# EAGLE design Communication (EAGLE 9.1.3)
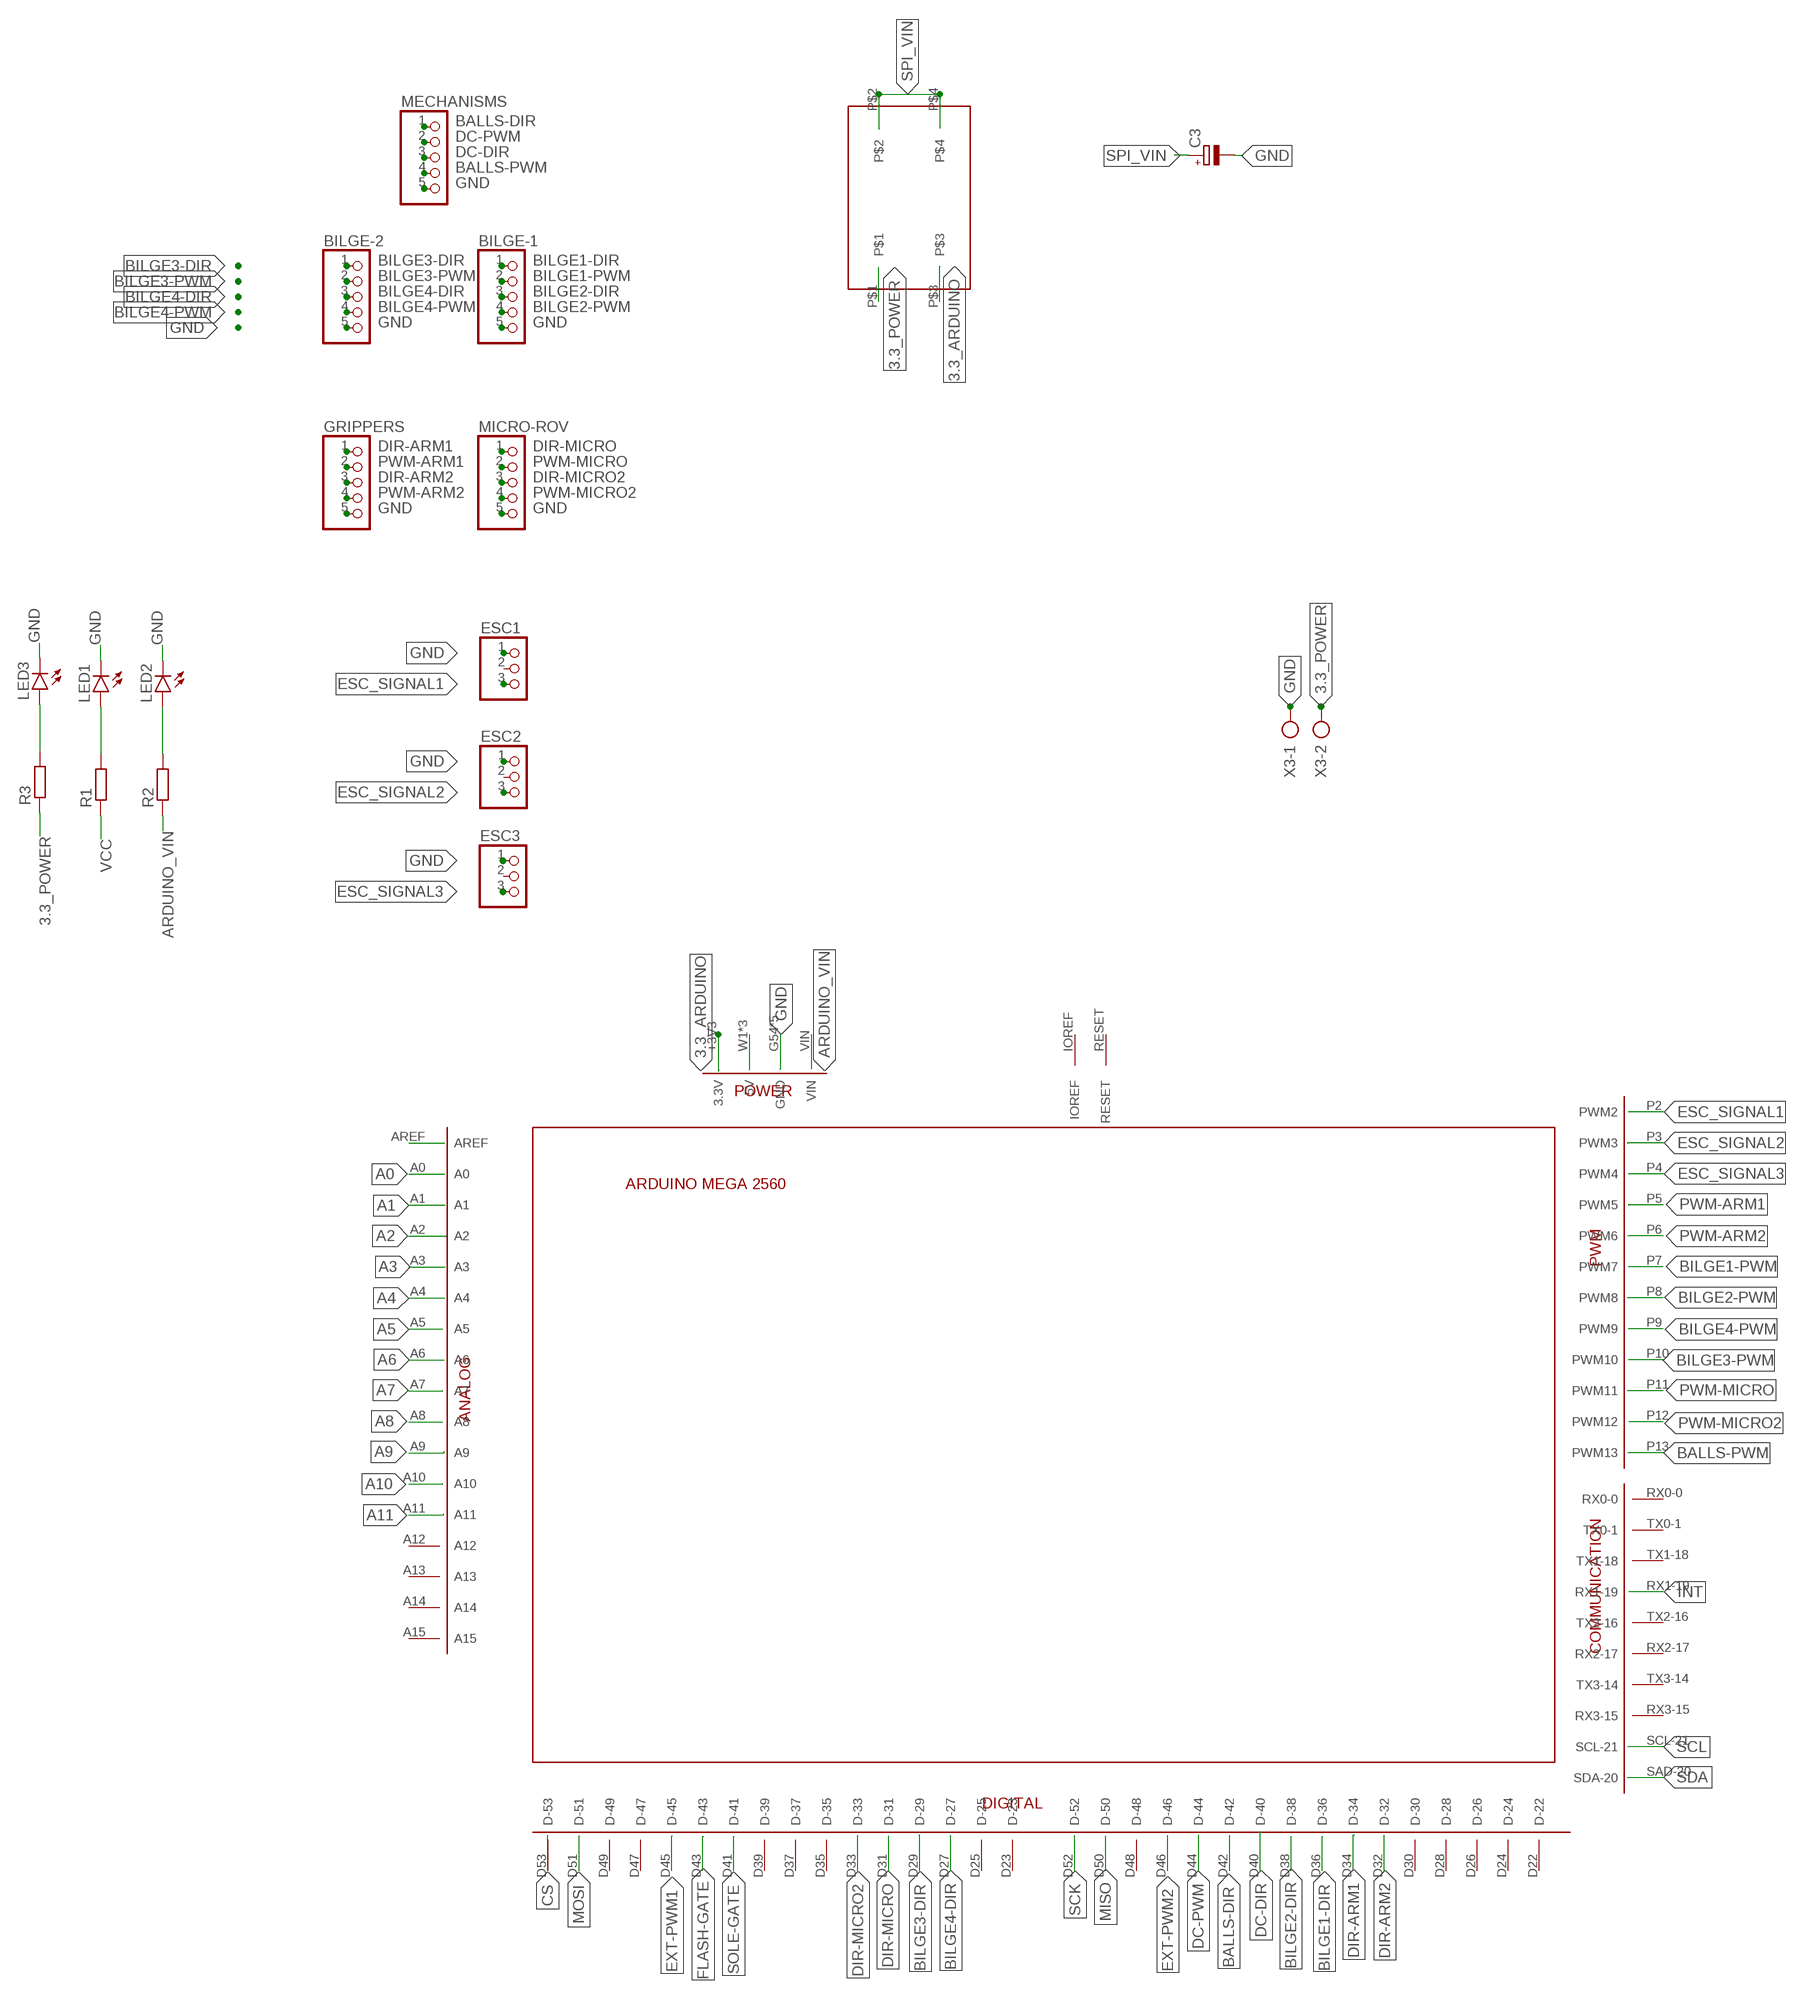
[diagram p0: schematic, sheet 1, part 1 of 2]
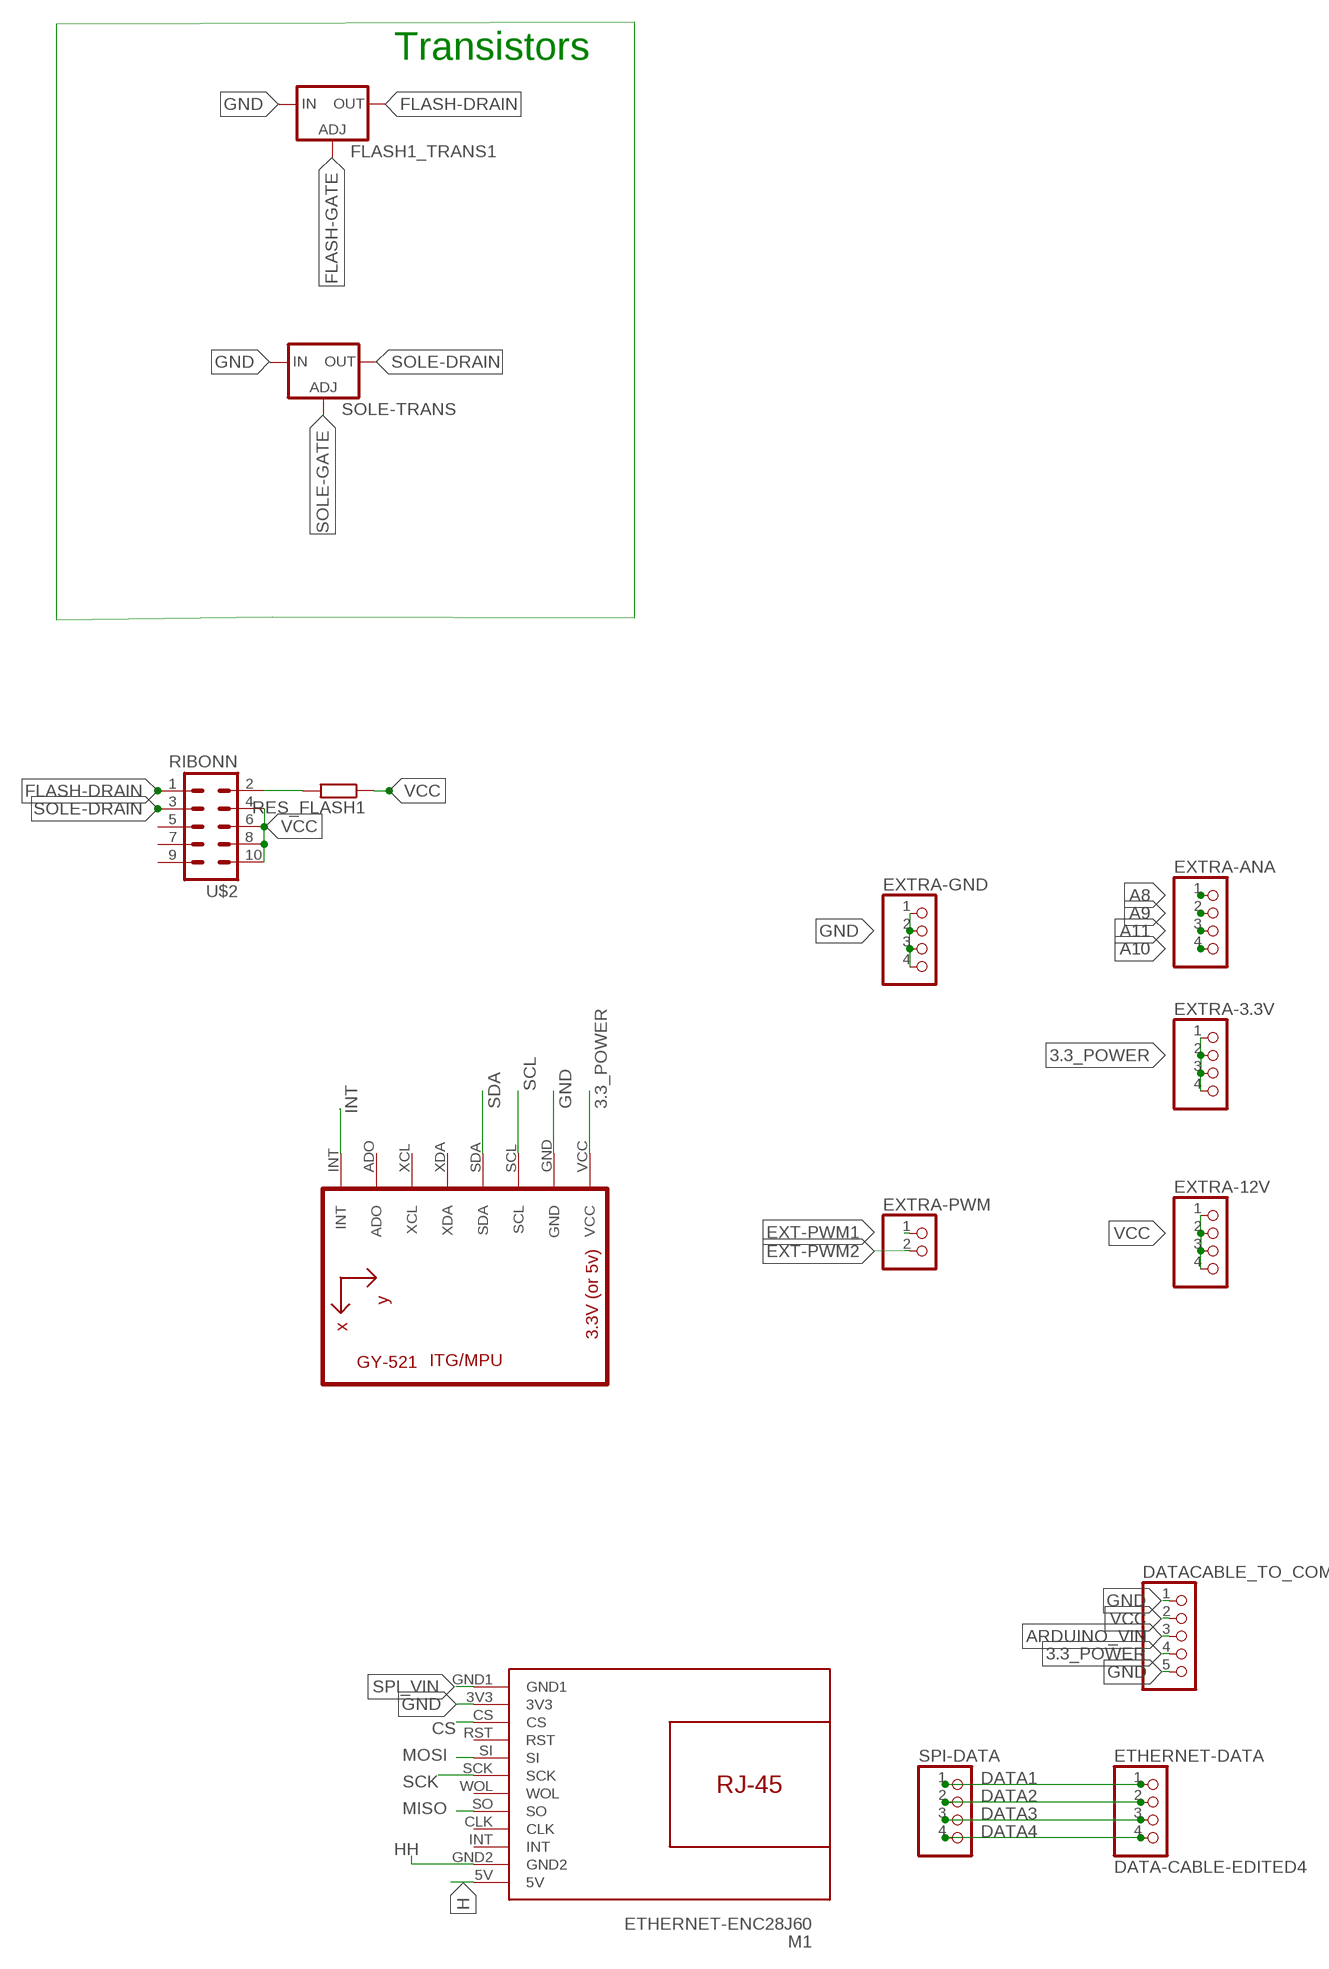
[diagram p1: schematic, sheet 1, part 2 of 2]

## Parts
BILGE-1  PINHD-1X5  [1X05]
BILGE-2  PINHD-1X5  [1X05]
C3  CPOL-EUE3.5-8  [E3,5-8]
DATACABLE_TO_COMM  PINHD-1X5  [1X05]
ESC1  PINHD-1X3  [1X03]
ESC2  PINHD-1X3  [1X03]
ESC3  PINHD-1X3  [1X03]
ETHERNET-DATA  DATA-CABLE-EDITED4  [DATA-CABLE-EDITED4]
EXTRA-3.3V  PINHD-1X4  [1X04]
EXTRA-12V  PINHD-1X4  [1X04]
EXTRA-ANA  PINHD-1X4  [1X04]
EXTRA-GND  PINHD-1X4  [1X04]
EXTRA-PWM  PINHD-1X2  [1X02]
FLASH1_TRANS1  LM317TS  [317TS]
GRIPPERS  PINHD-1X5  [1X05]
LED1  LED3MM  [LED3MM]
LED2  LED3MM  [LED3MM]
LED3  LED3MM  [LED3MM]
M1  ETHERNET-ENC28J60  [ETHERNET-ENC28J60]
MECHANISMS  PINHD-1X5  [1X05]
MICRO-ROV  PINHD-1X5  [1X05]
R1  R-EU_0207/10  [0207/10]
R2  R-EU_0207/10  [0207/10]
R3  R-EU_0207/10  [0207/10]
RES_FLASH1  R-EU_0207/10  [0207/10]
SOLE-TRANS  LM317TS  [317TS]
SPI-DATA  PINHD-1X4  [1X04]
U2  GY-521MPU6050  [GY-521]
U$1  BOARD_ARDUINO-MEGA  [BOARD_ARDUINO_MEGA]
U$2  RIBONN  [RIBONN]
U$3  DIPSWITCH_2PINS  [DIPSWITCH_2PINS]
X3  AK300/2  [AK300/2]

## Nets
3.3_ARDUINO: U$1.+3V3(3.3V) U$3.P$3
3.3_POWER: DATACABLE_TO_COMM.4 EXTRA-3.3V.1 EXTRA-3.3V.2 EXTRA-3.3V.3 EXTRA-3.3V.4 R3.1 U2.VCC U$3.P$1 X3.2
A0: U$1.A0
A1: U$1.A1
A2: U$1.A2
A3: U$1.A3
A4: U$1.A4
A5: U$1.A5
A6: U$1.A6
A7: U$1.A7
A8: EXTRA-ANA.1 U$1.A8
A9: EXTRA-ANA.2 U$1.A9
A10: EXTRA-ANA.4 U$1.A10
A11: EXTRA-ANA.3 U$1.A11
ARDUINO_VIN: DATACABLE_TO_COMM.3 R2.1 U$1.VIN
BALLS-DIR: MECHANISMS.1 U$1.D42(D-42)
BALLS-PWM: MECHANISMS.4 U$1.P13(PWM13)
BILGE1-DIR: BILGE-1.1 U$1.D36(D-36)
BILGE1-PWM: BILGE-1.2 U$1.P7(PWM7)
BILGE2-DIR: BILGE-1.3 U$1.D38(D-38)
BILGE2-PWM: BILGE-1.4 U$1.P8(PWM8)
BILGE3-DIR: BILGE-2.1 U$1.D29(D-29)
BILGE3-PWM: BILGE-2.2 U$1.P10(PWM10)
BILGE4-DIR: BILGE-2.3 U$1.D27(D-27)
BILGE4-PWM: BILGE-2.4 U$1.P9(PWM9)
CS: M1.CS U$1.D53(D-53)
DATA1: ETHERNET-DATA.1 SPI-DATA.1
DATA2: ETHERNET-DATA.2 SPI-DATA.2
DATA3: ETHERNET-DATA.3 SPI-DATA.3
DATA4: ETHERNET-DATA.4 SPI-DATA.4
DC-DIR: MECHANISMS.3 U$1.D40(D-40)
DC-PWM: MECHANISMS.2 U$1.D44(D-44)
DIR-ARM1: GRIPPERS.1 U$1.D34(D-34)
DIR-ARM2: GRIPPERS.3 U$1.D32(D-32)
DIR-MICRO: MICRO-ROV.1 U$1.D31(D-31)
DIR-MICRO2: MICRO-ROV.3 U$1.D33(D-33)
ESC_SIGNAL1: ESC1.3 U$1.P2(PWM2)
ESC_SIGNAL2: ESC2.3 U$1.P3(PWM3)
ESC_SIGNAL3: ESC3.3 U$1.P4(PWM4)
EXT-PWM1: EXTRA-PWM.1 U$1.D45(D-45)
EXT-PWM2: EXTRA-PWM.2 U$1.D46(D-46)
FLASH-DRAIN: FLASH1_TRANS1.2(OUT) U$2.1
FLASH-GATE: FLASH1_TRANS1.1(ADJ) U$1.D43(D-43)
GND: BILGE-1.5 BILGE-2.5 C3.- DATACABLE_TO_COMM.1 DATACABLE_TO_COMM.5 ESC1.1 ESC2.1 ESC3.1 EXTRA-GND.1 EXTRA-GND.2 EXTRA-GND.3 EXTRA-GND.4 FLASH1_TRANS1.3(IN) GRIPPERS.5 LED1.K(C) LED2.K(C) LED3.K(C) M1.3V3 MECHANISMS.5 MICRO-ROV.5 SOLE-TRANS.3(IN) U2.GND U$1.G54(GND) U$1.G55(GND) U$1.G56(GND) U$1.G57(GND) U$1.G58(GND) X3.1
H: M1.5V
HH: M1.GND2
INT: U2.INT U$1.RX1-19
MISO: M1.SO U$1.D50(D-50)
MOSI: M1.SI U$1.D51(D-51)
N$1: LED1.A R1.2
N$2: LED2.A R2.2
N$3: U$1.AREF
N$4: RES_FLASH1.2 U$2.2
N$11: LED3.A R3.2
N$119: U$1.W1(5V) U$1.W2(5V) U$1.W3(5V)
PWM-ARM1: GRIPPERS.2 U$1.P5(PWM5)
PWM-ARM2: GRIPPERS.4 U$1.P6(PWM6)
PWM-MICRO: MICRO-ROV.2 U$1.P11(PWM11)
PWM-MICRO2: MICRO-ROV.4 U$1.P12(PWM12)
SCK: M1.SCK U$1.D52(D-52)
SCL: U2.SCL U$1.SCL-21
SDA: U2.SDA U$1.SAD-20(SDA-20)
SOLE-DRAIN: SOLE-TRANS.2(OUT) U$2.3
SOLE-GATE: SOLE-TRANS.1(ADJ) U$1.D41(D-41)
SPI_VIN: C3.+ M1.GND1 U$3.P$2 U$3.P$4
VCC: DATACABLE_TO_COMM.2 EXTRA-12V.1 EXTRA-12V.2 EXTRA-12V.3 EXTRA-12V.4 R1.1 RES_FLASH1.1 U$2.4 U$2.6 U$2.8 U$2.10
Unconnected: ESC1.2 ESC2.2 ESC3.2 M1.CLK M1.INT M1.RST M1.WOL U2.ADO U2.XCL U2.XDA U$1.A12 U$1.A13 U$1.A14 U$1.A15 U$1.D22(D-22) U$1.D23(D-23) U$1.D24(D-24) U$1.D25(D-25) U$1.D26(D-26) U$1.D28(D-28) U$1.D30(D-30) U$1.D35(D-35) U$1.D37(D-37) U$1.D39(D-39) U$1.D47(D-47) U$1.D48(D-48) U$1.D49(D-49) U$1.IOREF U$1.RESET U$1.RX0-0 U$1.RX2-17 U$1.RX3-15 U$1.TX0-1 U$1.TX1-18 U$1.TX2-16 U$1.TX3-14 U$2.5 U$2.7 U$2.9

## Notes on the sheet
- Transistors

## Library data of the parts
BILGE-1 BILGE-2 DATACABLE_TO_COMM GRIPPERS MECHANISMS MICRO-ROV = pinhead:PINHD-1X5: PIN HEADER
C3 = rcl:CPOL-EU: POLARIZED CAPACITOR, European symbol; SPICEPREFIX: C
ESC1-ESC3 = pinhead:PINHD-1X3: PIN HEADER
ETHERNET-DATA = Data-Cable-Edited5:DATA-CABLE-EDITED4
EXTRA-3.3V EXTRA-12V EXTRA-ANA EXTRA-GND SPI-DATA = pinhead:PINHD-1X4: PIN HEADER
EXTRA-PWM = pinhead:PINHD-1X2: PIN HEADER
FLASH1_TRANS1 SOLE-TRANS = v-reg:LM317TS: VOLTAGE REGULATOR
LED1-LED3 = led:LED: LED OSRAM: - CHIPLED LG R971, LG N971, LY N971, LG Q971, LY Q971, LO R971, LY R971 LH N974, LH R974 LS Q976, LO Q976, LY Q976 LO Q996 - Hyper CHIPLED LW Q18S LB Q993, LB Q99A, LB R99A - SideLED LS A670, LO A670, LY A670, LG A670, LP A670 LB A673, LV A673, LT A673, LW A673 LH A674 LY A675 LS A676, LA A676, LO A676, LY A676, LW A676 LS A679, LY A679, LG A679 - Hyper Micro SIDELED® LS Y876, LA Y876, LO Y876, LY Y876 LT Y87S - SmartLED LW L88C, LW L88S LB L89C, LB L89S, LG L890 LS L89K, LO L89K, LY L89K LS L896, LA L896, LO L896, LY L896 - TOPLED LS T670, LO T670, LY T670, LG T670, LP T670 LSG T670, LSP T670, LSY T670, LOP T670, LYG T670 LG T671, LOG T671, LSG T671 LB T673, LV T673, LT T673, LW T673 LH T674 LS T676, LA T676, LO T676, LY T676, LB T676, LH T676, LSB T676, LW T676 LB T67C, LV T67C, LT T67C, LS T67K, LO T67K, LY T67K, LW E67C LS E67B, LA E67B, LO E67B, LY E67B, LB E67C, LV E67C, LT E67C LW T67C LS T679, LY T679, LG T679 LS T770, LO T770, LY T770, LG T770, LP T770 LB T773, LV T773, LT T773, LW T773 LH T774 LS E675, LA E675, LY E675, LS T675 LS T776, LA T776, LO T776, LY T776, LB T776 LHGB T686 LT T68C, LB T68C - Hyper Mini TOPLED® LB M676 - Mini TOPLED Santana® LG M470 LS M47K, LO M47K, LY M47K Source: http://www.osram.convergy.de LUXEON: - LUMILED® LXK2-PW12-R00, LXK2-PW12-S00, LXK2-PW14-U00, LXK2-PW14-V00 LXK2-PM12-R00, LXK2-PM12-S00, LXK2-PM14-U00 LXK2-PE12-Q00, LXK2-PE12-R00, LXK2-PE12-S00, LXK2-PE14-T00, LXK2-PE14-U00 LXK2-PB12-K00, LXK2-PB12-L00, LXK2-PB12-M00, LXK2-PB14-N00, LXK2-PB14-P00, LXK2-PB14-Q00 LXK2-PR12-L00, LXK2-PR12-M00, LXK2-PR14-Q00, LXK2-PR14-R00 LXK2-PD12-Q00, LXK2-PD12-R00, LXK2-PD12-S00 LXK2-PH12-R00, LXK2-PH12-S00 LXK2-PL12-P00, LXK2-PL12-Q00, LXK2-PL12-R00 Source: www.luxeon.com KINGBRIGHT: KA-3528ASYC Source: www.kingbright.com
M1 = Ethernet_TO_SPI Module:ETHERNET-ENC28J60: Ethernet Module based on ENC28J60 chip Click here to find device on ebay.com <http://www.ebay.com/sch/end28j60+ethernet+lan+module> Note: There are many variants. Search for the proper version.
R1-R3 RES_FLASH1 = rcl:R-EU_: RESISTOR, European symbol; SPICEPREFIX: R
U2 = MPU-5060 -with double pinheaders:GY-521
U$1 = Arduino Mega_EDITED:BOARD_ARDUINO-MEGA
U$2 = RIBONN:RIBONN
U$3 = dipswitch_2pins:DIPSWITCH_2PINS
X3 = con-ptr500:AK300/2: CONNECTOR; OC_FARNELL: unknown; OC_NEWARK: unknown

## Module FLASH
Ports: +12V(io) GND(io) PWM(in) -VE_FLASH(io)
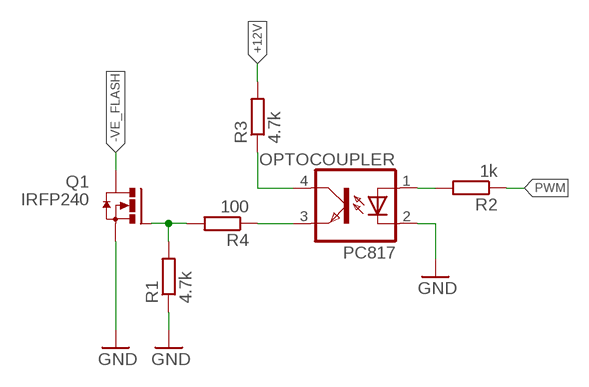
[diagram p2: schematic, module FLASH, sheet 1]

### Parts
OPTOCOUPLER  PC817  [DIL04]
Q1  IRFP240  [TO247BV]
R1  4.7k  R-EU_0207/10  [0207/10]
R2  1k  R-EU_0207/10  [0207/10]
R3  4.7k  R-EU_0207/10  [0207/10]
R4  100  R-EU_0207/10  [0207/10]

### Nets
+12V: R3.2
-VE_FLASH: Q1.D
GND: OPTOCOUPLER.2(C) Q1.S R1.1
N$1: Q1.G R1.2 R4.2
N$2: OPTOCOUPLER.4(COL) R3.1
N$3: OPTOCOUPLER.3(EMIT) R4.1
N$7: OPTOCOUPLER.1(A) R2.2
PWM: R2.1

### Library data of the parts
OPTOCOUPLER = optocoupler:PC817: SHARP OPTO COUPLER; MPN: PC817X4J000F; OC_FARNELL: 9707727; OC_NEWARK: 97K7059
Q1 = transistor-power:IRFP240: HEXFET Power MosFet Source: http://www.irf.com/
R1-R4 = rcl:R-EU_: RESISTOR, European symbol; SPICEPREFIX: R

## Board
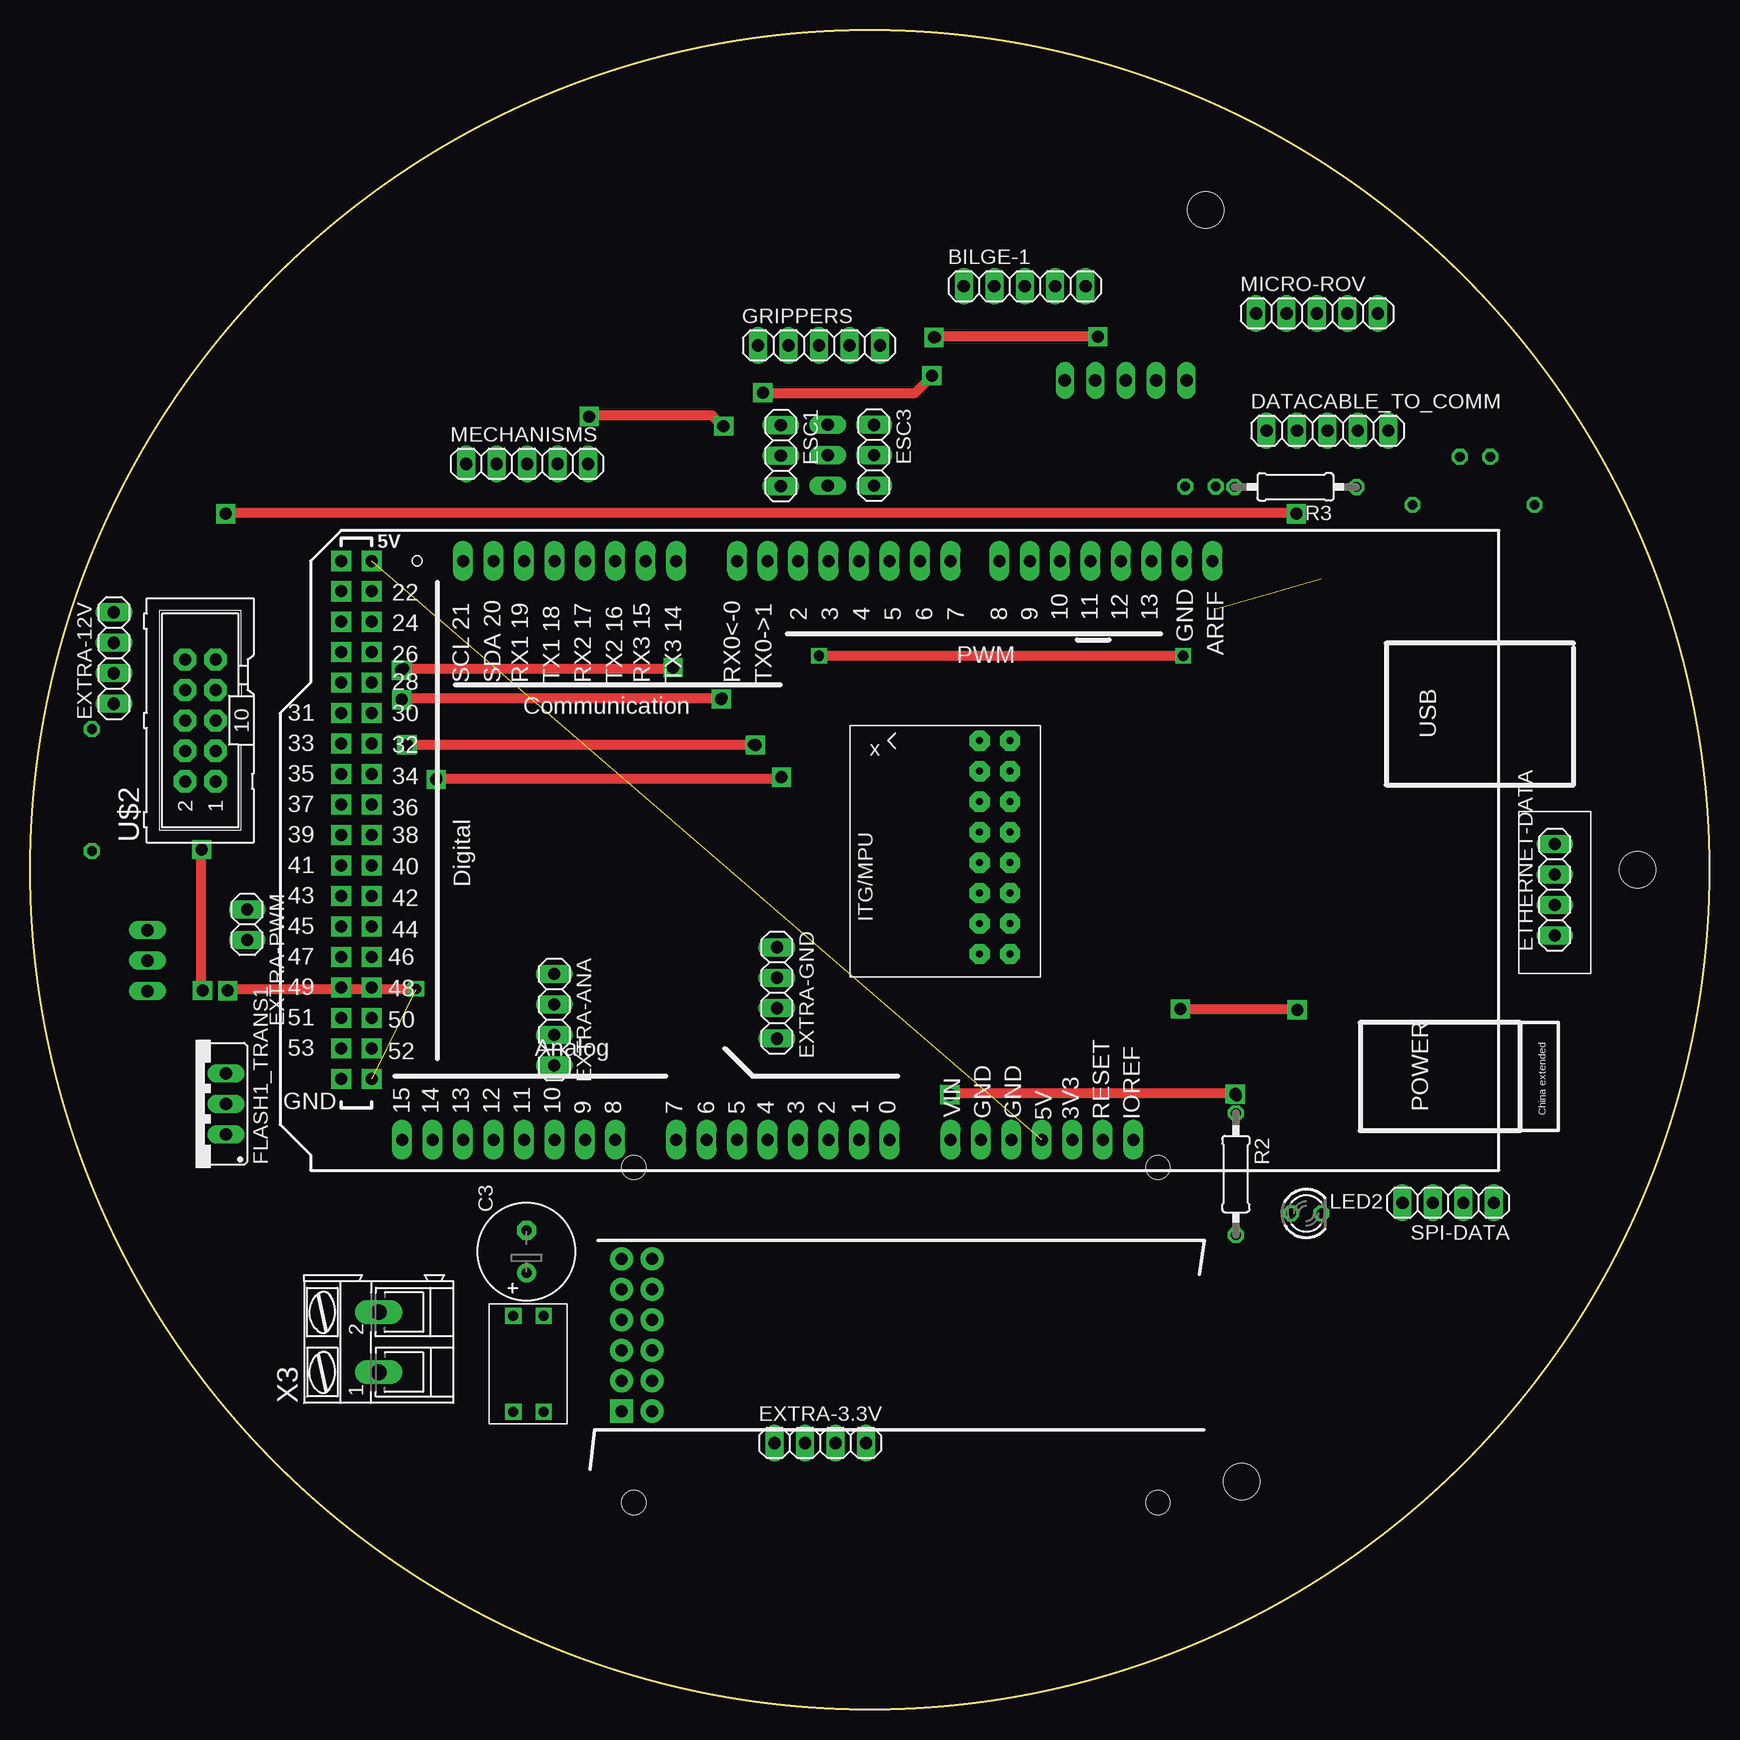
[diagram p3: board, top side]
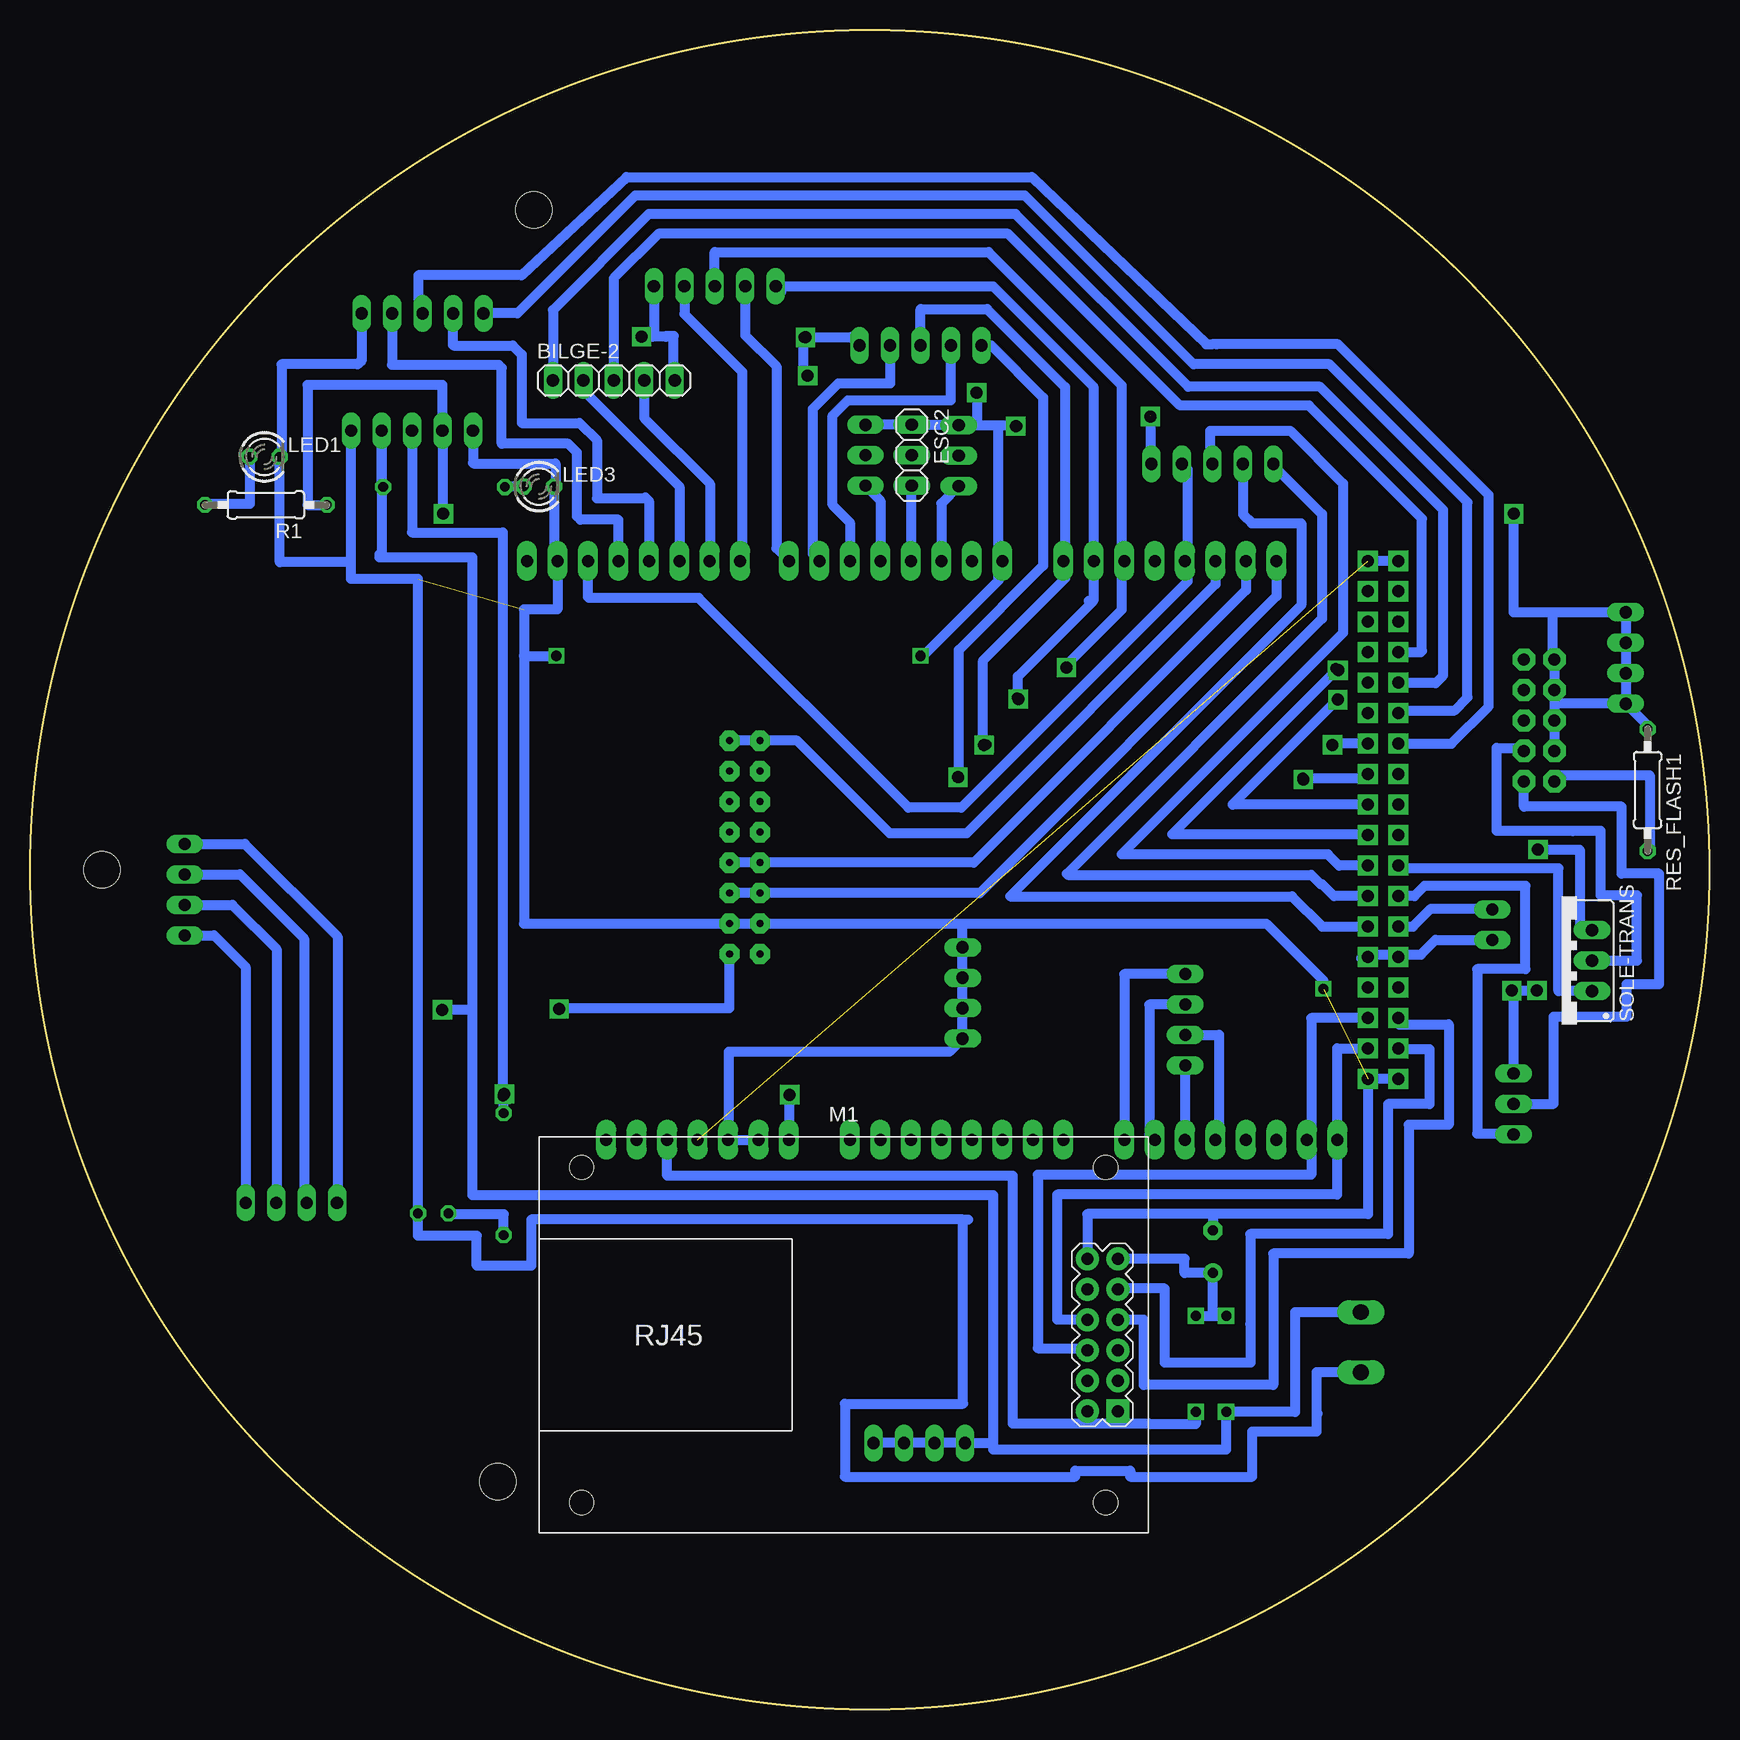
[diagram p4: board, bottom side, seen from below]

Size 140 x 140 mm. Coordinates in mm from the lower left corner, seen from the top.
Outline: circle at 70,70 radius 70
Copper layers (1*16): Top 0.035mm / dielectric 1.5mm / Bottom 0.035mm
Design rules "default *": minimum track width 0.5mm, minimum drill 0.35mm, track to track 0.8mm, track to pad 0.8mm, pad to pad 0.8mm, via to via 0.8mm, smd to smd 0.8mm, copper to edge 40mil, drill to drill 0.8mm, minimum pad ring 10mil, minimum via ring 8mil, stop-mask expansion 4mil, vias tented up to drill 0mil, thermal gap 10mil
Holes 3 mm at 134,70 101,19 98,125

### Footprints (pad centres in the part's own frame; a part is rotated, then mirrored left to right if it is on the bottom)
1X05 = drill 1.016 long: 1 -5.08,0; 2 -2.54,0; 3 0,0; 4 2.54,0; 5 5.08,0
E3,5-8 = drill 0.813 pad 1.6: + -1.778,0 | drill 0.813 pad 1.6 octagon: - 1.778,0
1X03 = drill 1.016 long: 1 -2.54,0; 2 0,0; 3 2.54,0
DATA-CABLE-EDITED4 = drill 1.016 long: 1 3.19,-3; 2 5.73,-3; 3 8.27,-3; 4 10.81,-3
1X04 = drill 1.016 long: 1 -3.81,0; 2 -1.27,0; 3 1.27,0; 4 3.81,0
1X02 = drill 1.016 long: 1 -1.27,0; 2 1.27,0
317TS = drill 1.016 long: 1 -2.54,-2.54; 2 0,-2.54; 3 2.54,-2.54
LED3MM = drill 0.813 octagon: A -1.27,0; K 1.27,0
ETHERNET-ENC28J60 = drill 1 pad 1.93: 3V3 20.32,6.35; 5V 20.32,-6.35; CLK 22.86,-3.81; CS 22.86,3.81; GND1 22.86,6.35; INT 20.32,-3.81; RST 20.32,3.81; SCK 20.32,1.27; SI 22.86,1.27; SO 20.32,-1.27; WOL 22.86,-1.27 | drill 1 pad 1.93 square: GND2 22.86,-6.35 | hole 2: -21.844,13.97; 21.844,13.97; -21.844,-13.97; 21.844,-13.97
0207/10 = drill 0.813 octagon: 1 -5.08,0; 2 5.08,0
GY-521 = drill 0.6 pad 1.7 octagon: ADO -8.89,-6.35; ADO1 -6.35,-6.35; GND -8.89,6.35; GND1 -6.35,6.35; INT -8.89,-8.89; INT1 -6.35,-8.89; SCL -8.89,3.81; SCL1 -6.35,3.81; SDA -8.89,1.27; SDA1 -6.35,1.27; VCC -8.89,8.89; VCC1 -6.35,8.89; XCL -8.89,-3.81; XCL1 -6.35,-3.81; XDA -8.89,-1.27; XDA1 -6.35,-1.27
BOARD_ARDUINO_MEGA = drill 1 pad 1.676 long: +3V3 35.56,50.8; A0 50.8,50.8; A1 53.34,50.8; A2 55.88,50.8; A3 58.42,50.8; A4 60.96,50.8; A5 63.5,50.8; A6 66.04,50.8; A7 68.58,50.8; A8 73.66,50.8; A9 76.2,50.8; A10 78.74,50.8; A11 81.28,50.8; A12 83.82,50.8; A13 86.36,50.8; A14 88.9,50.8; A15 91.44,50.8; AREF 23.876,2.54; G56 43.18,50.8; G57 40.64,50.8; G58 26.416,2.54; IOREF 30.48,50.8; P2 58.42,2.54; P3 55.88,2.54; P4 53.34,2.54; P5 50.8,2.54; P6 48.26,2.54; P7 45.72,2.54; P8 41.656,2.54; P9 39.116,2.54; P10 36.576,2.54; P11 34.036,2.54; P12 31.496,2.54; P13 28.956,2.54; RESET 33.02,50.8; RX0-0 63.5,2.54; RX1-19 81.28,2.54; RX2-17 76.2,2.54; RX3-15 71.12,2.54; SAD-20 83.82,2.54; SCL-21 86.36,2.54; TX0-1 60.96,2.54; TX1-18 78.74,2.54; TX2-16 73.66,2.54; TX3-14 68.58,2.54; VIN 45.72,50.8; W1 38.1,50.8 | drill 1 pad 1.676 square: D22 93.98,5.08; D23 96.52,5.08; D24 93.98,7.62; D25 96.52,7.62; D26 93.98,10.16; D27 96.52,10.16; D28 93.98,12.7; D29 96.52,12.7; D30 93.98,15.24; D31 96.52,15.24; D32 93.98,17.78; D33 96.52,17.78; D34 93.98,20.32; D35 96.52,20.32; D36 93.98,22.86; D37 96.52,22.86; D38 93.98,25.4; D39 96.52,25.4; D40 93.98,27.94; D41 96.52,27.94; D42 93.98,30.48; D43 96.52,30.48; D44 93.98,33.02; D45 96.52,33.02; D46 93.98,35.56; D47 96.52,35.56; D48 93.98,38.1; D49 96.52,38.1; D50 93.98,40.64; D51 96.52,40.64; D52 93.98,43.18; D53 96.52,43.18; G54 93.98,45.72; G55 96.52,45.72; W2 93.98,2.54; W3 96.52,2.54
RIBONN = drill 1 pad 1.85 octagon: 1 -5.08,-1.27; 2 -5.08,1.27; 3 -2.54,-1.27; 4 -2.54,1.27; 5 0,-1.27; 6 0,1.27; 7 2.54,-1.27; 8 2.54,1.27; 9 5.08,-1.27; 10 5.08,1.27
DIPSWITCH_2PINS = drill 0.85 square: P$1 2,1; P$2 2,9; P$3 4.54,1; P$4 4.54,9
AK300/2 = drill 1.321 long: 1 -2.515,0; 2 2.489,0

### Placement (x,y rotation side)
BILGE-1  82.92,118.65 0 top
BILGE-2  91.33,110.79 0 bottom
C3  41.39,38.17 90 top
DATACABLE_TO_COMM  108.16,106.6 0 top
ESC1  62.59,104.51 270 top
ESC2  66.5,104.56 270 bottom
ESC3  70.35,104.55 270 top
ETHERNET-DATA  124.1,61.34 90 top
EXTRA-3.3V  65.87,22.21 0 top
EXTRA-12V  6.99,87.65 90 top
EXTRA-ANA  43.7,57.5 270 top
EXTRA-GND  62.26,59.73 270 top
EXTRA-PWM  18.1,65.42 270 top
FLASH1_TRANS1  13.8,50.49 90 top
GRIPPERS  65.77,113.71 0 top
LED1  120.45,104.42 0 bottom
LED2  106.39,41.36 0 top
LED3  97.57,101.95 0 bottom
M1  72.18,31.22 0 bottom
MECHANISMS  41.43,103.84 0 top
MICRO-ROV  107.28,116.38 0 top
R1  120.34,100.41 180 bottom
R2  100.52,44.63 270 top
R3  105.49,101.91 180 top
RES_FLASH1  5.16,76.64 270 bottom
SOLE-TRANS  12.33,62.42 90 bottom
SPI-DATA  118.22,42.24 180 top
U2  72.8,71.87 180 top
U$1  122.45,98.29 180 top
U$2  14.19,82.45 90 top
U$3  38.28,23.81 0 top
X3  29.07,30.63 90 top

### Tracks (layer width: path | path; a pad name or v marks a point on that pad's centre or on a via)
3.3_ARDUINO
  Bottom 0.813: U$1.+3V3 86.89,44.5 58.07,44.5 58.07,23.82 46.69,23.82 46.66,23.79 46.22,23.79 42.82,23.79 U$3.P$3
3.3_POWER  (via drill 0.35, 0.85 pad 1.2)
  Top 0.813: v105.57,58.36 95.91,58.36 v95.85,58.42
  Bottom 0.813: EXTRA-3.3V.4 EXTRA-3.3V.3 EXTRA-3.3V.2 EXTRA-3.3V.1 59.71,22.21 | 103.14,58.3 103.14,96.06 110.89,96.06 110.89,96.28 110.7,96.28 DATACABLE_TO_COMM.4 110.7,101.91 R3.1 | 103.14,58.3 103.14,42.88 59.71,42.88 59.71,22.21 | 103.14,58.3 105.51,58.3 v105.57,58.36 | v95.85,58.42 v95.85,58.44 81.69,58.44 U2.VCC | X3.2 34.54,33.12 34.56,33.1 34.56,24.81 U$3.P$1 40.28,21.67 59.71,21.67 59.71,22.21
A8
  Bottom 0.813: EXTRA-ANA.1 48.79,61.31 U$1.A8
A9
  Bottom 0.813: EXTRA-ANA.2 46.69,58.77 46.69,47.93 U$1.A9
A10
  Bottom 0.813: EXTRA-ANA.4 U$1.A10
A11
  Bottom 0.813: EXTRA-ANA.3 40.88,56.23 40.88,47.78 U$1.A11
ARDUINO_VIN  (via drill 0.35)
  Top 0.813: v100.47,51.16 100.29,51.34 76.79,51.34 v76.71,51.26
  Bottom 0.813: DATACABLE_TO_COMM.3 108.16,98.12 100.59,98.12 100.59,51.16 | 100.59,51.16 v100.47,51.16 | v76.71,51.26 76.71,50.55 76.71,47.49 U$1.VIN | R2.1 100.52,51.09 100.59,51.16
BALLS-DIR
  Bottom 0.813: U$1.D42 31.31,67.81 32.31,68.81 32.43,68.81 33.19,69.57 53.5,69.57 53.58,69.65 32.31,90.92 32.31,99.66 36.35,103.7 MECHANISMS.1
BALLS-PWM
  Bottom 0.813: MECHANISMS.4 43.51,103.38 43.51,94.03 62.36,75.18 66.79,75.18 84.26,92.65 93.41,92.65 93.49,92.73 U$1.P13
BILGE1-DIR  (via drill 0.35)
  Top 0.813: v30.96,84.3 57.6,84.3 v57.65,84.35
  Bottom 0.813: U$1.D36 39.74,75.43 39.76,75.45 30.96,84.25 v30.96,84.3 | v57.65,84.35 57.65,86.11 51.36,92.4 | 51.36,92.4 51.75,92.4 | 77.84,118.94 BILGE-1.1 | 51.36,92.4 51.36,110.28 59.73,118.65 BILGE-1.1 | BILGE-1.1 77.36,118.17
BILGE1-PWM
  Bottom 0.813: U$1.P7 77.79,96.81 77.79,111.97 80.38,114.56 BILGE-1.2
BILGE2-DIR  (via drill 0.35)
  Top 0.813: v31.12,86.78 53.3,86.78 v53.59,87.07
  Bottom 0.813: U$1.D38 28.53,72.95 44.8,72.95 31.12,86.63 v31.12,86.78 | v53.59,87.07 48.98,91.68 48.98,110.36 60.1,121.48 82.92,121.48 BILGE-1.3 82.97,118.69
BILGE2-PWM
  Bottom 0.813: U$1.P8 80.62,95.92 80.62,111.49 83.74,114.61 85.46,116.33 BILGE-1.4
BILGE3-DIR
  Bottom 0.813: U$1.D29 22.85,85.59 22.82,85.56 22.19,86.19 22.19,99.99 32.46,110.26 43.45,110.26 57.84,124.65 88.42,124.65 96.41,116.66 BILGE-2.1
BILGE3-PWM
  Bottom 0.813: BILGE-2.2 93.87,109.95 85.87,101.95 U$1.P10
BILGE4-DIR
  Bottom 0.813: U$1.D27 24.09,88.13 23.96,88.26 23.96,99.26 33.39,108.69 44.14,108.69 58.47,123.02 87.61,123.02 91.33,119.3 BILGE-2.3
BILGE4-PWM
  Bottom 0.813: U$1.P9 83.32,95.76 83.32,102.18 88.79,107.65 BILGE-2.4
CS
  Bottom 0.813: U$1.D53 25.93,55.05 23.35,55.05 23.35,50.47 26.8,50.47 26.8,39.64 38.29,39.64 38.29,32.14 38.26,32.14 38.26,28.9 45.41,28.9 45.41,35.09 49.32,35.09 M1.CS
DATA1
  Bottom 0.813: SPI-DATA.1 122.03,61.9 124.66,64.53 ETHERNET-DATA.1
DATA2
  Bottom 0.813: ETHERNET-DATA.2 123.14,67.07 119.45,63.38 119.45,42.28 SPI-DATA.2
DATA3
  Bottom 0.813: ETHERNET-DATA.3 122.49,69.61 117.15,64.27 117.15,42.44 SPI-DATA.3
DATA4
  Bottom 0.813: ETHERNET-DATA.4 122.09,72.15 114.37,64.43 114.37,42.28 SPI-DATA.4
DC-DIR
  Bottom 0.813: U$1.D40 30.88,70.35 31.81,71.28 49.02,71.28 30.55,89.75 30.55,102.2 34.94,106.59 41.64,106.59 41.64,104.05 MECHANISMS.3
DC-PWM
  Bottom 0.813: U$1.D44 32.29,65.27 34.81,67.79 58.31,67.79 34.04,92.06 34.04,98.88 38.16,98.88 38.89,99.61 MECHANISMS.2
DIR-ARM1  (via drill 0.35)
  Top 0.813: v33.89,77.61 v62.57,77.61
  Bottom 0.813: U$1.D34 28.83,77.61 v33.89,77.61 | v62.57,77.61 62.57,88.32 55.55,95.34 55.55,109.37 59.89,113.71 GRIPPERS.1
DIR-ARM2  (via drill 0.35)
  Top 0.813: v31.36,80.45 60.25,80.45 v60.3,80.4
  Bottom 0.813: U$1.D32 31.3,80.51 v31.36,80.45 | v60.3,80.4 60.55,80.65 60.55,87.45 53.71,94.29 53.71,110.24 60.22,116.75 65.77,116.75 GRIPPERS.3
DIR-MICRO
  Bottom 0.813: U$1.D31 25.69,83.29 21.24,83.29 20.17,84.36 20.17,100.63 31.67,112.13 43.01,112.13 57.07,126.19 89.55,126.19 99.36,116.38 MICRO-ROV.1
DIR-MICRO2
  Bottom 0.813: U$1.D33 21.51,80.51 18.4,83.62 18.4,101.25 30.96,113.81 41.09,113.81 41.5,113.81 41.94,113.81 56.5,127.73 90.27,127.73 99.04,119.55 107.64,119.55 107.64,117.58 107.28,117.22 MICRO-ROV.3
ESC_SIGNAL1
  Bottom 0.813: ESC1.3 64.03,100.53 U$1.P2
ESC_SIGNAL2
  Bottom 0.813: ESC2.3 66.57,101.95 U$1.P3
ESC_SIGNAL3
  Bottom 0.813: ESC3.3 69.11,100.77 U$1.P4
EXT-PWM1
  Bottom 0.813: EXTRA-PWM.1 18.18,66.77 23.21,66.77 24.71,65.27 U$1.D45
EXT-PWM2
  Bottom 0.813: 29.04,62.63 28.57,62.63 U$1.D46 28.27,62.93 24.06,62.93 22.84,64.15 EXTRA-PWM.2
FLASH-DRAIN
  Bottom 0.813: U$2.1 15.46,75.26 7.33,75.26 7.33,69.67 4.19,69.67 4.19,60.46 6.9,60.46 6.9,57.76 13,57.76 13,50.48 FLASH1_TRANS1.2
FLASH-GATE
  Bottom 0.813: FLASH1_TRANS1.1 16.34,48.02 19.37,48.02 19.37,61.71 15.34,61.71 15.34,68.65 23.76,68.65 24.6,67.81 U$1.D43
GND  (via drill 0.35, 0.85 pad 1.3)  (3 unrouted)
  Top 0.813: v32.15,60.04 v16.39,60.04 | v14.25,71.6 14.25,59.94 v14.23,59.92 | v57.73,106.99 56.86,107.86 46.59,107.86 | v96.15,87.82 65.68,87.82 v65.62,87.76 | v89.05,114.42 75.56,114.42 v75.51,114.37 75.45,114.37 v75.41,114.41 | v61.04,109.7 61.04,109.75 73.79,109.75 v75.2,111.16
  Bottom 0.813: ESC1.1 66.45,107.05 ESC2.1 ESC3.1 | 79.22,47.54 U$1.G56 U$1.G57 81.76,47.54 81.76,54.82 63.36,54.82 EXTRA-GND.4 EXTRA-GND.3 EXTRA-GND.2 EXTRA-GND.1 62.32,63.54 62.32,65.52 | U$1.G55 U$1.G54 28.47,41.3 41.39,41.3 | M1.3V3 51.86,41.3 41.39,41.3 | 62.32,65.52 U2.GND 98.83,65.52 98.83,87.82 | FLASH1_TRANS1.3 16.34,60.04 v16.39,60.04 16.39,59.92 v14.37,59.92 v14.23,59.92 | 113.25,95.63 113.25,94.24 107.66,94.24 LED2.K 107.66,39.49 102.77,39.49 102.77,37 98.21,37 98.21,40.84 62.22,40.84 | 113.25,95.63 DATACABLE_TO_COMM.5 | 113.25,95.63 119.19,95.63 LED1.K 119.03,104.58 119.03,112.14 112.69,112.14 112.33,112.5 112.36,112.53 MICRO-ROV.5 | v32.15,60.04 32.15,60.72 36.95,65.52 62.32,65.52 | 98.83,87.82 98.83,91.69 96.03,91.69 U$1.G58 96.3,95.75 LED3.K 96.2,102.05 96.2,103.86 103.04,103.86 103.08,103.9 DATACABLE_TO_COMM.1 | SOLE-TRANS.3 10.82,64.96 10.82,71.67 14.18,71.67 v14.25,71.6 | ESC1.1 59.26,107.05 | 59.26,107.05 57.79,107.05 v57.73,106.99 | 46.59,107.86 46.59,103.92 MECHANISMS.5 | 98.83,87.82 v96.15,87.82 | v65.62,87.76 59.26,94.12 59.26,107.05 | v75.41,114.41 71.55,114.41 GRIPPERS.5 | X3.1 32.77,28.12 32.77,24.66 | 32.77,24.66 32.67,24.66 | 62.22,40.84 62.22,25.49 72.07,25.49 72.07,19.41 52.88,19.41 52.86,19.43 52.86,19.9 48.29,19.9 48.29,19.41 38.11,19.41 38.11,23.16 32.77,23.16 32.77,24.66 | 62.22,40.84 61.81,40.84 | ESC1.1 61.04,107.05 v61.04,109.7 | v75.2,111.16 75.51,111.16 v75.51,114.37 | 41.39,41.3 C3.- | BILGE-2.5 86.35,110.88 86.35,114.49 | 86.35,114.49 86.94,114.49 87.01,114.42 | 86.35,114.49 86.42,114.42 88.11,114.42 | 88.11,114.42 v89.05,114.42 | BILGE-1.5 88,114.53 88.11,114.42
INT
  Bottom 0.813: U$1.RX1-19 41.17,93.8 61.93,73.04 68.33,73.04 76.05,80.76 U2.INT
MISO
  Bottom 0.813: U$1.D50 33.19,57.64 33.19,44.58 56,44.58 56,30.11 51.86,30.11 M1.SO
MOSI
  Bottom 0.813: U$1.D51 25.93,57.12 21.73,57.12 21.73,48.74 25.07,48.74 25.07,38.02 36.37,38.02 36.37,27.05 47.16,27.05 47.16,32.49 M1.SI
N$1
  Bottom 0.813: R1.2 125.41,100.49 121.68,100.49 121.68,104.38 LED1.A
N$2
  Bottom 0.813: R2.2 100.52,41.29 105.05,41.29 LED2.A
N$4
  Bottom 0.813: U$2.2 12.4,77.89 4.99,77.89 4.99,71.73 RES_FLASH1.2
N$5  (via drill 0.85 pad 1.2)
  other vias: 105.64,58.35
N$6  (via drill 0.85 pad 1.2)
  other vias: 100.59,51.12
N$7  (via drill 0.85 pad 1.2)
  other vias: 76.76,51.21
N$8  (via drill 0.85 pad 1.3)
  other vias: 96.13,87.84
N$9  (via drill 0.85 pad 1.3)
  other vias: 65.77,87.83
N$10  (via drill 0.85 pad 1.3)
  other vias: 62.59,77.65
N$11
  Bottom 0.813: LED3.A 100.41,101.95 R3.2
N$12  (via drill 0.85 pad 1.3)
  other vias: 60.3,80.44
N$13  (via drill 0.85 pad 1.3)
  other vias: 57.71,84.36
N$14  (via drill 0.85 pad 1.3)
  other vias: 53.63,86.82
N$15  (via drill 0.85 pad 1.3)
  other vias: 33.92,77.67
N$16  (via drill 0.85 pad 1.3)
  other vias: 31.39,80.44
N$17  (via drill 0.85 pad 1.3)
  other vias: 31.01,84.25
N$18  (via drill 0.85 pad 1.3)
  other vias: 31.16,86.8
N$19  (via drill 0.85 pad 1.3)
  other vias: 32.19,60.07
N$20  (via drill 0.85 pad 1.3)
  other vias: 16.41,59.96
N$21  (via drill 0.85 pad 1.3)
  other vias: 14.28,71.63
N$22  (via drill 0.85 pad 1.3)
  other vias: 16.36,99.69
N$24  (via drill 0.85 pad 1.3)
  other vias: 46.6,107.83
N$25  (via drill 0.85 pad 1.3)
  other vias: 57.71,106.97
N$26  (via drill 0.85 pad 1.3)
  other vias: 89.07,114.46
N$27  (via drill 0.85 pad 1.3)
  other vias: 105.59,99.68
N$28  (via drill 1 pad 1.6)
  other vias: 46.6,107.79
N$29  (via drill 1 pad 1.6)
  other vias: 57.83,106.97
N$30  (via drill 1 pad 1.6)
  other vias: 61.09,109.78
N$31  (via drill 1 pad 1.6)
  other vias: 75.17,111.18
N$32  (via drill 1 pad 1.6)
  other vias: 75.35,114.38
N$33  (via drill 1 pad 1.6)
  other vias: 89.02,114.43
N$34  (via drill 1 pad 1.6)
  other vias: 105.55,99.67
N$35  (via drill 1 pad 1.6)
  other vias: 16.32,99.67
N$36  (via drill 1 pad 1.6)
  other vias: 53.6,86.85
N$37  (via drill 1 pad 1.6)
  other vias: 57.62,84.23
N$38  (via drill 1 pad 1.6)
  other vias: 60.49,80.4
N$39  (via drill 1 pad 1.6)
  other vias: 62.65,77.71
N$40  (via drill 1 pad 1.6)
  other vias: 33.85,77.52
N$41  (via drill 1 pad 1.6)
  other vias: 31.42,80.41
N$42  (via drill 1 pad 1.6)
  other vias: 30.97,84.17
N$43  (via drill 1 pad 1.6)
  other vias: 30.94,86.63
N$44  (via drill 1 pad 1.6)
  other vias: 14.3,71.7
N$45  (via drill 1 pad 1.6)
  other vias: 14.38,59.94
N$46  (via drill 1 pad 1.6)
  other vias: 16.47,59.92
N$47  (via drill 1 pad 1.6)
  other vias: 76.67,51.25
N$48  (via drill 1 pad 1.6)
  other vias: 100.46,51.31
N$49  (via drill 1 pad 1.6)
  other vias: 95.89,58.39
N$50  (via drill 1 pad 1.6)
  other vias: 105.63,58.33
N$119  (1 unrouted)
  Bottom 0.813: U$1.W3 U$1.W2
PWM-ARM1
  Bottom 0.813: U$1.P5 71.65,98.95 73.1,100.4 73.1,107.86 71.82,109.14 63.23,109.14 GRIPPERS.2
PWM-ARM2
  Bottom 0.813: U$1.P6 74.77,96.33 74.77,108.41 72.64,110.54 68.31,110.54 GRIPPERS.4
PWM-MICRO
  Bottom 0.813: MICRO-ROV.2 104.74,113.74 104.69,113.69 99.76,113.69 99.01,112.94 99.01,107.24 94.19,107.24 92.75,105.8 92.75,100.97 88.8,100.97 88.72,101.05 88.41,100.74 U$1.P11
PWM-MICRO2
  Bottom 0.813: MICRO-ROV.4 109.83,112.08 100.92,112.08 100.67,111.83 100.67,105.51 95.13,105.51 94.41,104.79 94.41,99.46 94.12,99.17 90.95,99.17 U$1.P12 90.99,95.79
SCK
  Bottom 0.813: 51.94,32.41 M1.SCK 54.36,32.49 54.36,42.93 31.04,42.93 31.04,55.11 U$1.D52
SCL
  Bottom 0.813: U2.SCL 60.83,68.06 36.09,92.8 U$1.SCL-21
SDA
  Bottom 0.813: U2.SDA 61.33,70.6 38.63,93.3 U$1.SAD-20
SOLE-DRAIN
  Bottom 0.813: SOLE-TRANS.2 6.05,62.42 6.05,67.86 9.07,67.86 9.07,73.24 11.47,73.24 | 11.47,73.24 11.33,73.24 | 11.47,73.24 17.73,73.24 17.73,80.16 15.46,80.16 U$2.3
SOLE-GATE
  Bottom 0.813: SOLE-TRANS.1 12.59,59.88 12.59,70.12 25.7,70.12 U$1.D41
SPI_VIN
  Bottom 0.813: U$3.P$4 41.39,32.81 | 41.39,32.81 U$3.P$2 | 41.39,32.81 C3.+ 43.76,36.39 43.76,37.57 M1.GND1
VCC  (via drill 0.35)
  Top 0.813: v16.34,99.72 105.47,99.72 v105.51,99.76
  Bottom 0.813: U$2.10 U$2.8 12.92,83.84 | 12.92,83.84 U$2.6 U$2.4 | EXTRA-12V.1 EXTRA-12V.2 EXTRA-12V.3 EXTRA-12V.4 13.11,91.46 | RES_FLASH1.1 5.16,82.01 EXTRA-12V.1 | EXTRA-12V.1 12.92,83.84 | v105.51,99.76 105.62,99.76 DATACABLE_TO_COMM.2 105.62,110.41 116.87,110.41 116.87,100.41 R1.1 | 12.84,87.53 U$2.10 | v16.34,99.72 16.34,91.46 13.11,91.46 | 13.11,91.46 13.11,87.53 U$2.10

### Text on the board
BD-Top: gnd | gnd | gnd | gnd | gnd | gnd | gnd | gnd | Extra 12V | gnd | Extra PWM | Extra gnd | gnd | Extra Analog | 3.3V | Arduino | gnd | power | Extra 3.3V